# EAGLE design LED_current_source_buffer_only (EAGLE 7.7.0)
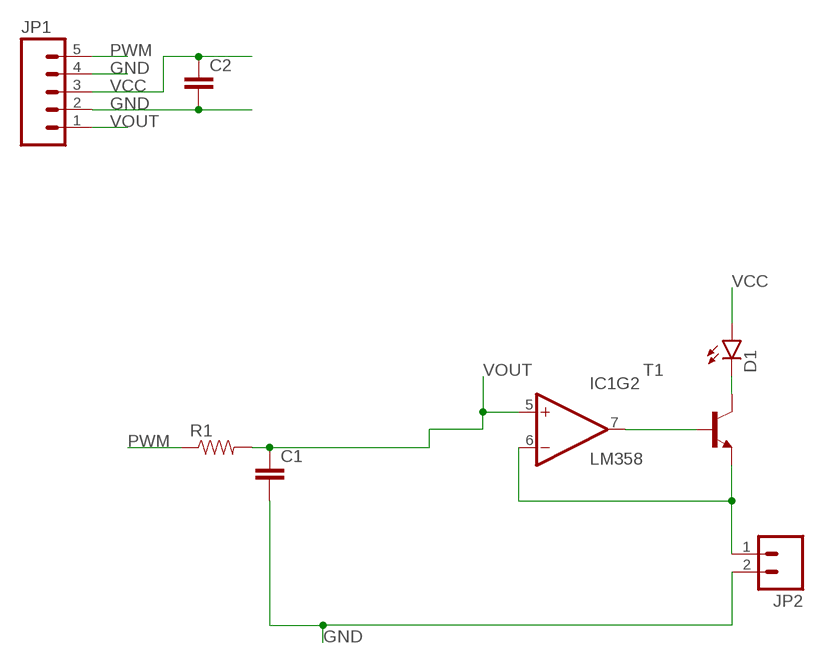
[diagram p0: schematic, sheet 1]

## Parts
C1  CAP0603-CAP  [0603-CAP]
C2  CAP0603-CAP  [0603-CAP]
D1  LED5MM  [LED5MM]
IC1  LM358  [DIP08]
JP1  M05PTH  [1X05]
JP2  M02PTH  [1X02]
R1  RESISTOR0603-RES  [0603-RES]
T1  2N2222-NPN-TO92-EBC  [TO92-EBC]

## Nets
GND: C1.2 C2.2 JP1.2 JP1.4 JP2.2
N$1: IC1.6(-IN) JP2.1 T1.E
N$7: IC1.7(OUT) T1.B
N$9: D1.K(C) T1.C
PWM: JP1.5 R1.1
VCC: C2.1 D1.A JP1.3
VOUT: C1.1 IC1.5(+IN) JP1.1 R1.2
Unconnected: IC1.1(OUT) IC1.2(-IN) IC1.3(+IN)

## Power pins joined to a net without a drawn wire
V+: IC1.8(V+)
V-: IC1.4(V-)

## Library data of the parts
C1 C2 = SparkFun-Passives:CAP: Capacitor Standard 0603 ceramic capacitor, and 0.1" leaded capacitor.
D1 = SparkFun-LED:LED: LEDs Standard schematic elements and footprints for 5mm, 3mm, 1206, and 0603 sized LEDs. 5mm - Spark Fun Electronics SKU : COM-00529 (and others)
IC1 = SparkFun-AnalogIC:LM358: Jellybean op-amp; PROD_ID: IC-09172
JP1 = SparkFun-Connectors:M05: Header 5 Standard 5-pin 0.1" header. Use with straight break away headers (SKU : PRT-00116), right angle break away headers (PRT-00553), swiss pins (PRT-00743), machine pins (PRT-00117), and female headers (PRT-00115). Molex polarized connector foot print use with SKU : PRT-08230 with associated crimp pins and housings.
JP2 = SparkFun-Connectors:M02: Standard 2-pin 0.1" header. Use with - straight break away headers ( PRT-00116) - right angle break away headers (PRT-00553) - swiss pins (PRT-00743) - machine pins (PRT-00117) - female headers (PRT-00115) Molex polarized connector foot print use with: PRT-08233 with associated crimp pins and housings. 2.54_SCREWTERM for use with PRT-10571. 3.5mm Screw Terminal footprints for PRT-08084 5mm Screw Terminal footprints for use with PRT-08432
R1 = SparkFun-Passives:RESISTOR: Resistor Basic schematic elements and footprints for 0603, 1206, and PTH resistors.
T1 = transistor-neu-to92:*-NPN-: NPN Transistror

## Board
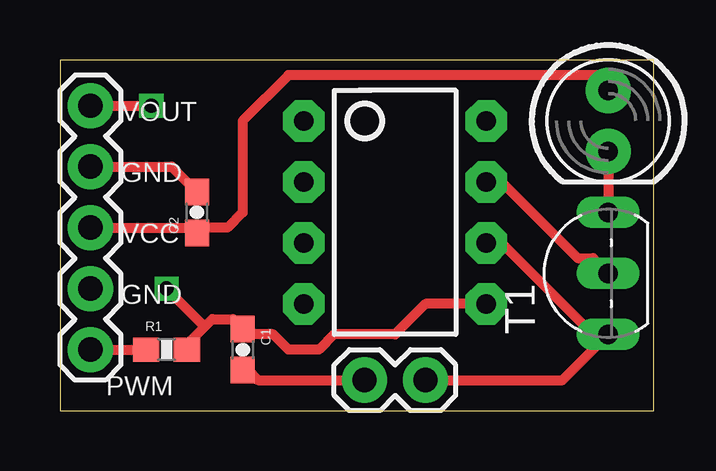
[diagram p1: board, top side]
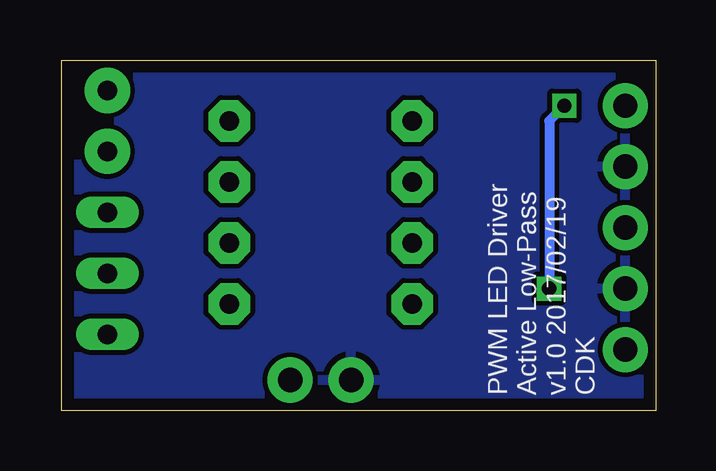
[diagram p2: board, bottom side, seen from below]

Size 24.76 x 14.61 mm. Coordinates in mm from the lower left corner, seen from the top.
Outline: 0,0 24.76,0 24.76,14.61 0,14.61 0,0
Copper layers (1*16): Top 0.035mm / dielectric 1.5mm / Bottom 0.035mm
Design rules "default *": minimum track width 10mil, minimum drill 24mil, track to track 8mil, track to pad 8mil, pad to pad 8mil, via to via 8mil, smd to smd 8mil, copper to edge 20mil, drill to drill 8mil, minimum pad ring 10mil, minimum via ring 8mil, stop-mask expansion 4mil, vias tented up to drill 13mil, thermal gap 10mil

### Footprints (pad centres in the part's own frame; a part is rotated, then mirrored left to right if it is on the bottom)
0603-CAP = smd 1.1 x 1: 1 -0.85,0; 2 0.85,0
LED5MM = drill 0.813 pad 1.88: A -1.27,0; K 1.27,0
DIP08 = drill 0.813 pad 1.727 octagon: 1 -3.81,-3.81; 2 -1.27,-3.81; 3 1.27,-3.81; 4 3.81,-3.81; 5 3.81,3.81; 6 1.27,3.81; 7 -1.27,3.81; 8 -3.81,3.81
1X05 = drill 1.016 pad 1.88: 1 0,0; 2 2.54,0; 3 5.08,0; 4 7.62,0; 5 10.16,0
1X02 = drill 1.016 pad 1.88: 1 0,0; 2 2.54,0
0603-RES = smd 1.1 x 1: 1 -0.85,0; 2 0.85,0
TO92-EBC = drill 0.813 long: B 0,-1.27; C 2.54,-1.27; E -2.54,-1.27

### Placement (x,y rotation side)
C1  7.62,2.54 270 top
C2  5.71,8.26 90 top
D1  22.86,12.07 270 top
IC1  13.97,8.26 270 top
JP1  1.27,12.7 270 top
JP2  15.24,1.27 180 top
R1  4.45,2.54 0 top
T1  21.59,5.71 90 top

### Tracks (layer width: path | path; a pad name or v marks a point on that pad's centre or on a via)
GND
  Top 0.406: C1.2 7.84,1.69 8.26,1.27 JP2.2 | JP1.2 4.66,10.16 C2.2
  pour Bottom: -2.54,19.05 30.48,19.05 30.48,-1.91 -2.54,-1.91
N$1
  Top 0.406: IC1.6 18.41,6.99 22.22,3.18 T1.E 20.95,1.27 JP2.1
N$7
  Top 0.406: IC1.7 18.41,9.53 21.59,6.35 22.22,6.35 T1.B
N$9
  Top 0.406: D1.K T1.C
PWM
  Top 0.406: JP1.5 R1.1
VCC
  Top 0.406: D1.A 22.86,13.97 9.53,13.97 7.62,12.07 7.62,8.26 6.99,7.62 5.93,7.62 C2.1 5.5,7.62 JP1.3
VOUT  (via drill 0.6)
  Top 0.406: IC1.5 15.24,4.45 13.97,3.18 11.43,3.18 10.79,2.54 9.53,2.54 8.89,3.18 7.84,3.18 C1.1 7.2,3.81 6.35,3.81 6.03,3.49 | R1.2 5.29,2.76 6.03,3.49 | JP1.1 v3.81,12.7 | v4.45,5.08 6.03,3.49
  Bottom 0.406: v3.81,12.7 4.45,12.07 v4.45,5.08

### Text on the board
tPlace: VOUT | GND | VCC | GND | PWM
bPlace: PWM LED Driver / Active Low-Pass / v1.0 2017/02/19 / CDK